# Altium schematic sheet ver061_LPF.SchDoc
size A3; SheetNumber: 6; SheetTotal: 6
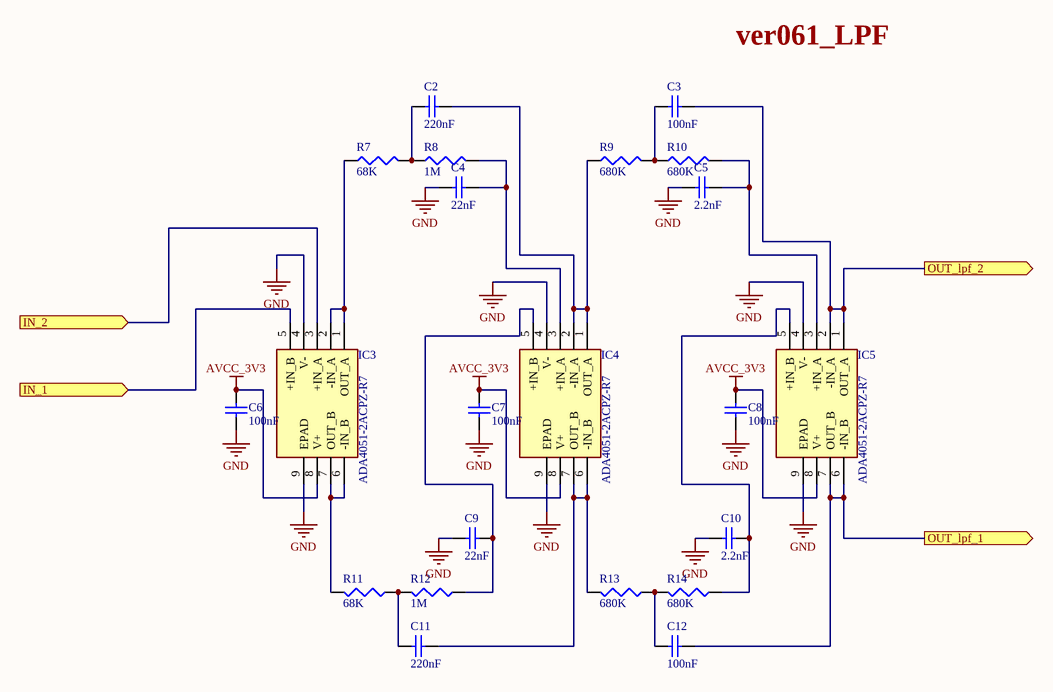
[diagram p0: ver061_LPF.SchDoc]

## Parts
C2  value 220nF  [0402]  (hidden comment: Cap Semi)
C3  value 100nF  [0402]  (hidden comment: Cap Semi)
C4  value 22nF  [0402]  (hidden comment: Cap Semi)
C5  value 2.2nF  [0402]  (hidden comment: Cap Semi)
C6  value 100nF  [1608[0603]]  (hidden comment: Cap Semi)
C7  value 100nF  [1608[0603]]  (hidden comment: Cap Semi)
C8  value 100nF  [1608[0603]]  (hidden comment: Cap Semi)
C9  value 22nF  [0402]  (hidden comment: Cap Semi)
C10  value 2.2nF  [0402]  (hidden comment: Cap Semi)
C11  value 220nF  [0402]  (hidden comment: Cap Semi)
C12  value 100nF  [0402]  (hidden comment: Cap Semi)
IC3  ADA4051-2ACPZ-R7  [DFN300X300X90-9N]
IC4  ADA4051-2ACPZ-R7  [DFN300X300X90-9N]
IC5  ADA4051-2ACPZ-R7  [DFN300X300X90-9N]
R7  value 68K  [RESC1005X35N]  (hidden comment: Res3)
R8  value 1M  [RESC1005X35N]  (hidden comment: Res3)
R9  value 680K  [RESC1005X35N]  (hidden comment: Res3)
R10  value 680K  [RESC1005X35N]  (hidden comment: Res3)
R11  value 68K  [RESC1005X35N]  (hidden comment: Res3)
R12  value 1M  [RESC1005X35N]  (hidden comment: Res3)
R13  value 680K  [RESC1005X35N]  (hidden comment: Res3)
R14  value 680K  [RESC1005X35N]  (hidden comment: Res3)

## Ports
IN_1 (in), IN_2 (in), OUT_lpf_1 (out), OUT_lpf_2 (out)

## Nets
AVCC_3V3: C6.2 C7.2 C8.2 IC3.8(V+) IC4.8(V+) IC5.8(V+)
GND: C4.1 C5.1 C6.1 C7.1 C8.1 C9.1 C10.1 IC3.4(V-) IC3.9(EPAD) IC4.4(V-) IC4.9(EPAD) IC5.4(V-) IC5.9(EPAD)
IN_1: IC3.5(+IN_B) ; port IN_1
IN_2: IC3.3(+IN_A) ; port IN_2
OUT_lpf_1: C12.2 IC5.6(-IN_B) IC5.7(OUT_B) ; port OUT_lpf_1
OUT_lpf_2: C3.2 IC5.1(OUT_A) IC5.2(-IN_A) ; port OUT_lpf_2
NetC2_1: C2.1 R7.1 R8.2
NetC2_2: C2.2 IC4.1(OUT_A) IC4.2(-IN_A) R9.2
NetC3_1: C3.1 R9.1 R10.2
NetC4_2: C4.2 IC4.3(+IN_A) R8.1
NetC5_2: C5.2 IC5.3(+IN_A) R10.1
NetC9_2: C9.2 IC4.5(+IN_B) R12.1
NetC10_2: C10.2 IC5.5(+IN_B) R14.1
NetC11_1: C11.1 R11.1 R12.2
NetC11_2: C11.2 IC4.6(-IN_B) IC4.7(OUT_B) R13.2
NetC12_1: C12.1 R13.1 R14.2
NetIC3_1: IC3.1(OUT_A) IC3.2(-IN_A) R7.2
NetIC3_6: IC3.6(-IN_B) IC3.7(OUT_B) R11.2

## Notes on the sheet
- ver061_LPF

## Library data of the parts
C2-C12 = Cap Semi: Capacitor (Semiconductor SIM Model); Published: 8-Jun-2000; LatestRevisionDate: 29-May-2009; LatestRevisionNote: IPC-7351 Footprint Added.; PackageReference: C1206; Publisher: Altium Limited; PackageDescription: Chip Capacitor
IC3-IC5 = ADA4051-2ACPZ-R7: Integrated Circuit; Manufacturer_Name: Analog Devices; Manufacturer_Part_Number: ADA4051-2ACPZ-R7; Mouser Part Number: 584-ADA4051-2ACPZ-R7; Mouser Price/Stock: https://www.mouser.co.uk/ProductDetail/Analog-Devices/ADA4051-2ACPZ-R7?qs=BpaRKvA4VqFJoopj8kXVMQ%3D%3D; Arrow Part Number: ADA4051-2ACPZ-R7; Arrow Price/Stock: https://www.arrow.com/en/products/ada4051-2acpz-r7/analog-devices
R7-R14 = Res3: Resistor; Published: 8-Jun-2000; LatestRevisionDate: 29-May-2009; LatestRevisionNote: IPC-7351 Footprint Added.; PackageReference: J1-0603; Publisher: Altium Limited; PackageDescription: Chip Resistor